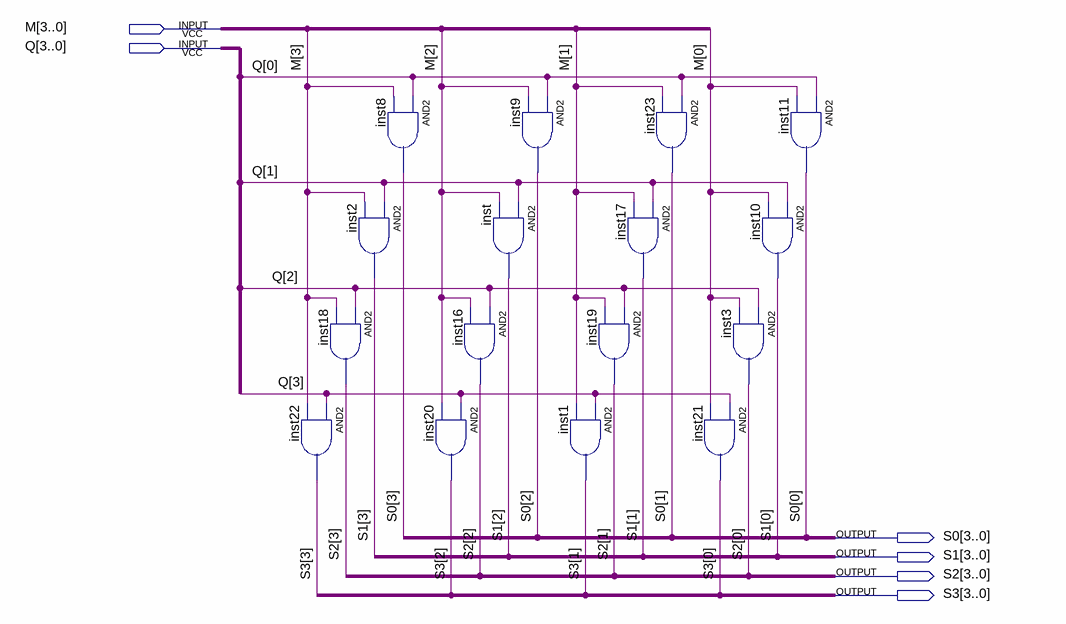
[diagram p0: schematic sheet]
// Quartus schematic AND_Grid.bdf as structural Verilog: 16 symbols, 6 pins
module AND_Grid (
  input  [3:0] M,
  input  [3:0] Q,
  output [3:0] S0,
  output [3:0] S1,
  output [3:0] S2,
  output [3:0] S3
);

  and inst22 (S3[3], Q[3], M[3]);
  and inst8 (S0[3], Q[0], M[3]);
  and inst2 (S1[3], Q[1], M[3]);
  and inst18 (S2[3], Q[2], M[3]);
  and inst16 (S2[2], Q[2], M[2]);
  and inst20 (S3[2], Q[3], M[2]);
  and inst9 (S0[2], Q[0], M[2]);
  and inst (S1[2], Q[1], M[2]);
  and inst17 (S1[1], Q[1], M[1]);
  and inst19 (S2[1], Q[2], M[1]);
  and inst1 (S3[1], Q[3], M[1]);
  and inst23 (S0[1], Q[0], M[1]);
  and inst21 (S3[0], Q[3], M[0]);
  and inst10 (S1[0], Q[1], M[0]);
  and inst3 (S2[0], Q[2], M[0]);
  and inst11 (S0[0], Q[0], M[0]);
endmodule
